# EAGLE design mainboard (EAGLE 7.5.0)
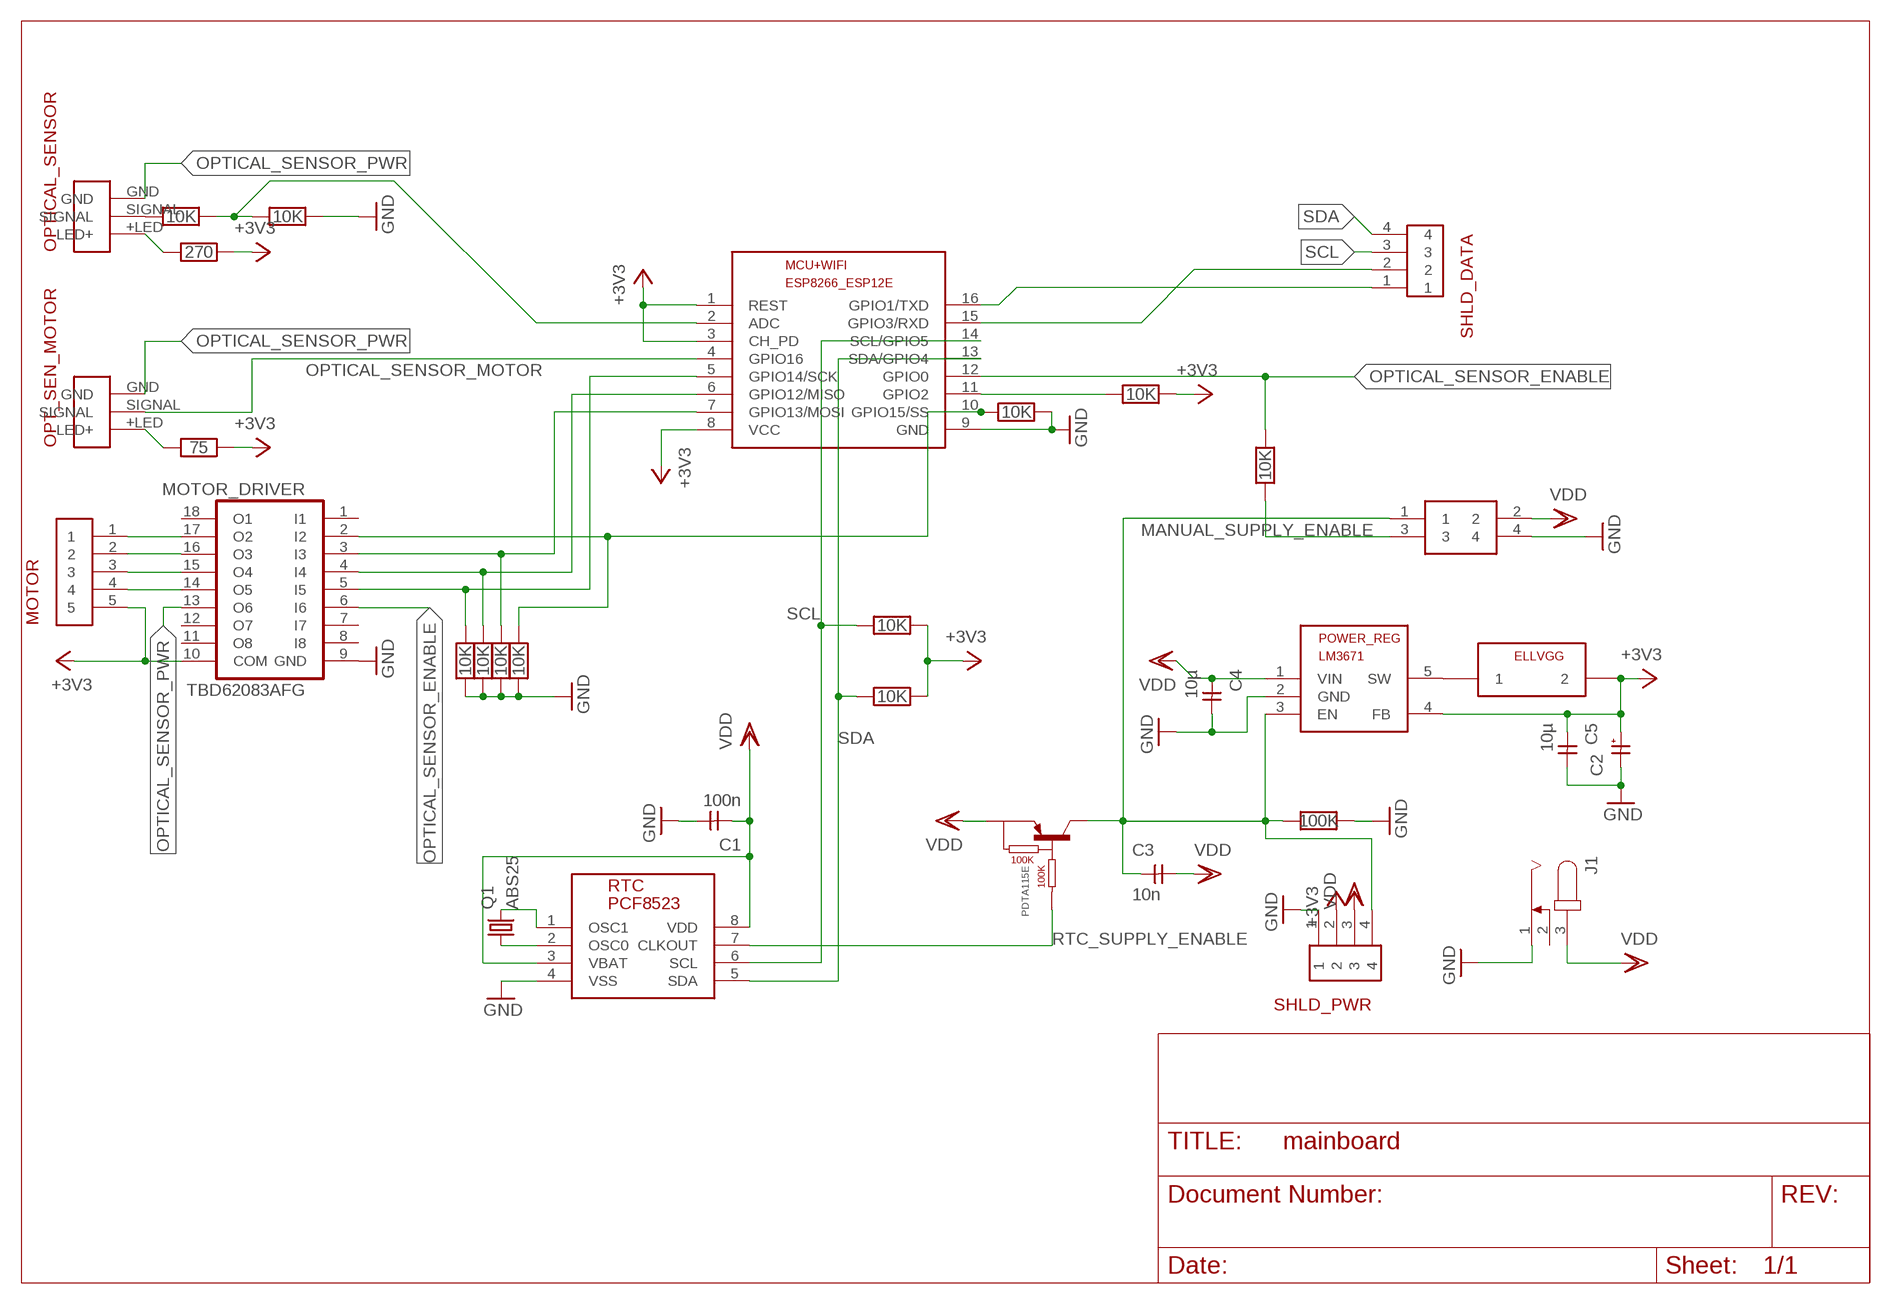
[diagram p0: schematic, sheet 1]

## Parts
C1  100n  CSMD_1206  [SMD_RC_1206]
C2  C_POLSMD_M6.3  [C_M6.3]
C3  10n  CSMD_1206  [SMD_RC_1206]
C4  10µ  CSMD_1206  [SMD_RC_1206]
C5  10µ  CSMD_1206  [SMD_RC_1206]
DIL_SWITCH  HEADER_2X2  [HEADER_2X2]
J1  JACK-PLUG0  [SPC4077]
L1  ELLVGG  [ELLVGG]
MCU+WIFI  ESP8266-12EESP8266-ESP12E  [ESP8266-ESP12E]
MOTOR  B5B-XH-A  [B5B-XH-A]
MOTOR_DRIVER  TBD62083AFG  [SO18]
OPT_SEN_MOTOR  ENDSTOP  [ENDSTOP]
OPTICAL_SENSOR  ENDSTOP  [ENDSTOP]
POWER_REG  LM3671NO_EXTRA_PAD  [SOT23-5L-SIMPLE]
Q1  ABS25  [ABS25]
R1  270  RSMD_1206  [SMD_RC_1206]
R2  10K  RSMD_1206  [SMD_RC_1206]
R3  10K  RSMD_1206  [SMD_RC_1206]
R4  100K  RSMD_1206  [SMD_RC_1206]
R5  10K  RSMD_1206  [SMD_RC_1206]
R6  10K  RSMD_1206  [SMD_RC_1206]
R7  10K  RSMD_1206  [SMD_RC_1206]
R8  10K  RSMD_1206  [SMD_RC_1206]
R9  10K  RSMD_1206  [SMD_RC_1206]
R10  10K  RSMD_1206  [SMD_RC_1206]
R11  10K  RSMD_1206  [SMD_RC_1206]
R12  10K  RSMD_1206  [SMD_RC_1206]
R13  10K  RSMD_1206  [SMD_RC_1206]
R14  75  RSMD_1206  [SMD_RC_1206]
RTC  PCF8523TS  [SO8]
SHLD_DATA  HEADER_1X4  [HEADER_1X4]
SHLD_PWR  HEADER_1X4  [HEADER_1X4]
T1  PDTA115ET  [SOT23]

## Nets
+3V3: C2.+ C5.P$1 L1.P$2 MCU+WIFI.1(REST) MCU+WIFI.3(CH_PD) MCU+WIFI.8(VCC) MOTOR.5 MOTOR_DRIVER.10(COM) POWER_REG.4(FB) R1.P$2 R9.P$2 R10.P$2 R11.P$2 R14.P$2 SHLD_PWR.2
GND: C1.P$2 C2.GND C4.P$2 C5.P$2 DIL_SWITCH.4 J1.1 MCU+WIFI.9(GND) MOTOR_DRIVER.9(GND) POWER_REG.2(GND) R3.P$2 R4.P$1 R5.P$1 R6.P$1 R7.P$2 R12.P$1 R13.P$1 RTC.4(VSS) SHLD_PWR.1
MANUAL_SUPPLY_ENABLE: C3.P$1 DIL_SWITCH.1 POWER_REG.3(EN) R4.P$2 SHLD_PWR.4 T1.3(C)
N$1: MOTOR.1 MOTOR_DRIVER.17(O2)
N$2: Q1.4 RTC.1(OSC1)
N$3: L1.P$1 POWER_REG.5(SW)
N$4: MOTOR.2 MOTOR_DRIVER.16(O3)
N$6: MCU+WIFI.7(GPIO13/MOSI) MOTOR_DRIVER.3(I3) R12.P$2
N$7: MCU+WIFI.6(GPIO12/MISO) MOTOR_DRIVER.4(I4) R6.P$2
N$8: MOTOR.3 MOTOR_DRIVER.15(O4)
N$9: MOTOR.4 MOTOR_DRIVER.14(O5)
N$10: OPT_SEN_MOTOR.+LED(LED+) R14.P$1
N$11: MCU+WIFI.11(GPIO2) R11.P$1
N$13: MCU+WIFI.16(GPIO1/TXD) SHLD_DATA.1
N$14: MCU+WIFI.15(GPIO3/RXD) SHLD_DATA.2
N$16: MCU+WIFI.5(GPIO14/SCK) MOTOR_DRIVER.5(I5) R5.P$2
N$17: MCU+WIFI.10(GPIO15/SS) MOTOR_DRIVER.2(I2) R7.P$1 R13.P$2
N$18: MCU+WIFI.2(ADC) R2.P$2 R3.P$1
N$19: DIL_SWITCH.3 R8.P$2
N$20: OPTICAL_SENSOR.SIGNAL R2.P$1
N$22: OPTICAL_SENSOR.+LED(LED+) R1.P$1
OPTICAL_SENSOR_ENABLE: MCU+WIFI.12(GPIO0) MOTOR_DRIVER.6(I6) R8.P$1
OPTICAL_SENSOR_MOTOR: MCU+WIFI.4(GPIO16) OPT_SEN_MOTOR.SIGNAL
OPTICAL_SENSOR_PWR: MOTOR_DRIVER.13(O6) OPT_SEN_MOTOR.GND OPTICAL_SENSOR.GND
RTC_OSC: Q1.1 RTC.2(OSC0)
RTC_SUPPLY_ENABLE: RTC.7(CLKOUT) T1.1(B)
SCL: MCU+WIFI.14(SCL/GPIO5) R9.P$1 RTC.6(SCL) SHLD_DATA.3
SDA: MCU+WIFI.13(SDA/GPIO4) R10.P$1 RTC.5(SDA) SHLD_DATA.4
VDD: C1.P$1 C3.P$2 C4.P$1 DIL_SWITCH.2 J1.3 POWER_REG.1(VIN) RTC.3(VBAT) RTC.8(VDD) SHLD_PWR.3 T1.2(E)
Unconnected: J1.2 MOTOR_DRIVER.1(I1) MOTOR_DRIVER.7(I7) MOTOR_DRIVER.8(I8) MOTOR_DRIVER.11(O8) MOTOR_DRIVER.12(O7) MOTOR_DRIVER.18(O1)

## Library data of the parts
C1 C3-C5 = balance:C
C2 = balance:C_POL
DIL_SWITCH = balance:HEADER_2X2
J1 = con-jack:JACK-PLUG: DC POWER JACK Power Jack, DC, Right Angle, Through Hole, Rated 5A at 16VDC, PC Terminals Distributor: Farnell (www.Farnell.de) Drawing: 84N1161.pdf / 84N1162.pdf Manufacturer: SPC Technology (www.spctechnology.com) Type: SPC4077 / SPC 4078; OC_FARNELL: unknown; OC_NEWARK: unknown
L1 = balance:ELLVGG
MCU+WIFI = balance:ESP8266-12E: ESP8266-12E with additional I/O and GPIO04/05 corrected The author cannot warrant that this library is free from error or will meet your specific requirements. Created by PuceBaboon.com. Komagane, Nagano, JAPAN
MOTOR = balance:B5B-XH-A
MOTOR_DRIVER = balance:TBD62083AFG: DRIVER ARRAY
OPT_SEN_MOTOR OPTICAL_SENSOR = balance:ENDSTOP
POWER_REG = balance:LM3671
Q1 = balance:ABS25: kHz RANGE CRYSTAL UNIT SMD Source: MC-306_405_406_E07X.PDF Homepage <http://www.epsontoyocom.co.jp>
R1-R14 = balance:R
RTC = balance:PCF8523TS
SHLD_DATA SHLD_PWR = balance:HEADER_1X4
T1 = balance:PDTA115ET

## Net classes
0 default: clearance 0.205 mm

## Board
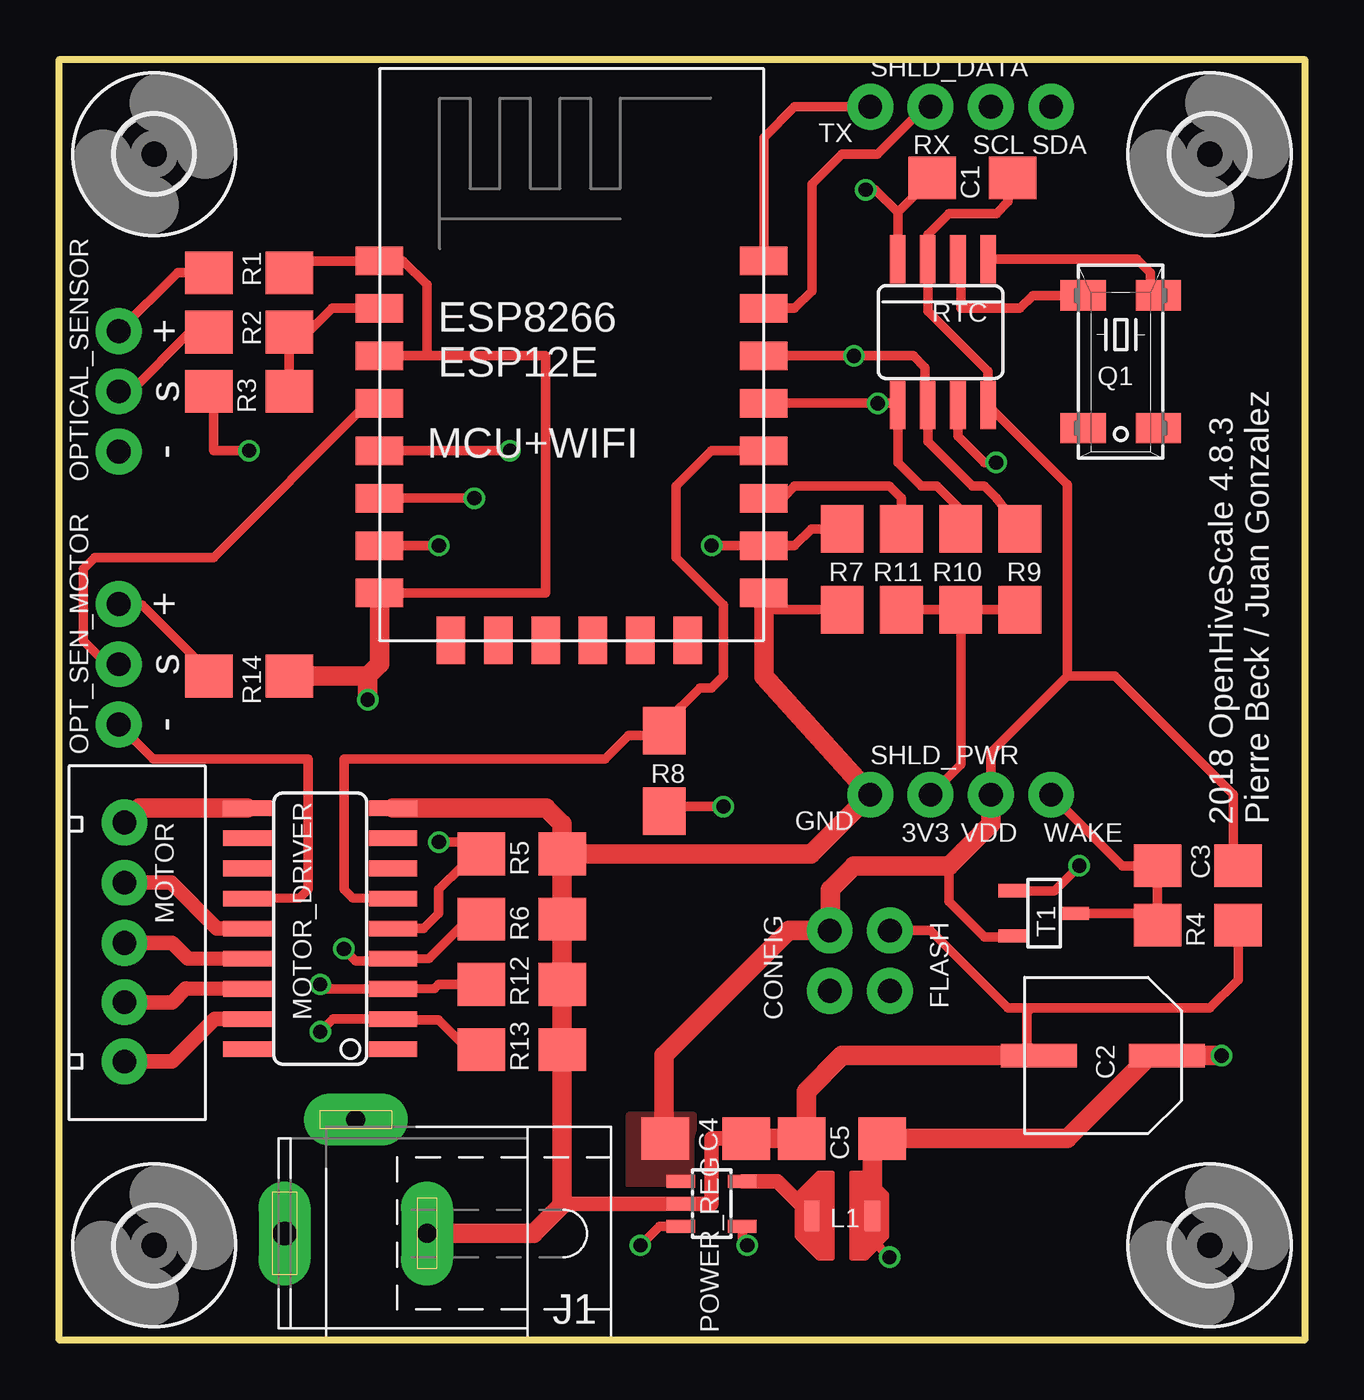
[diagram p1: board, top side]
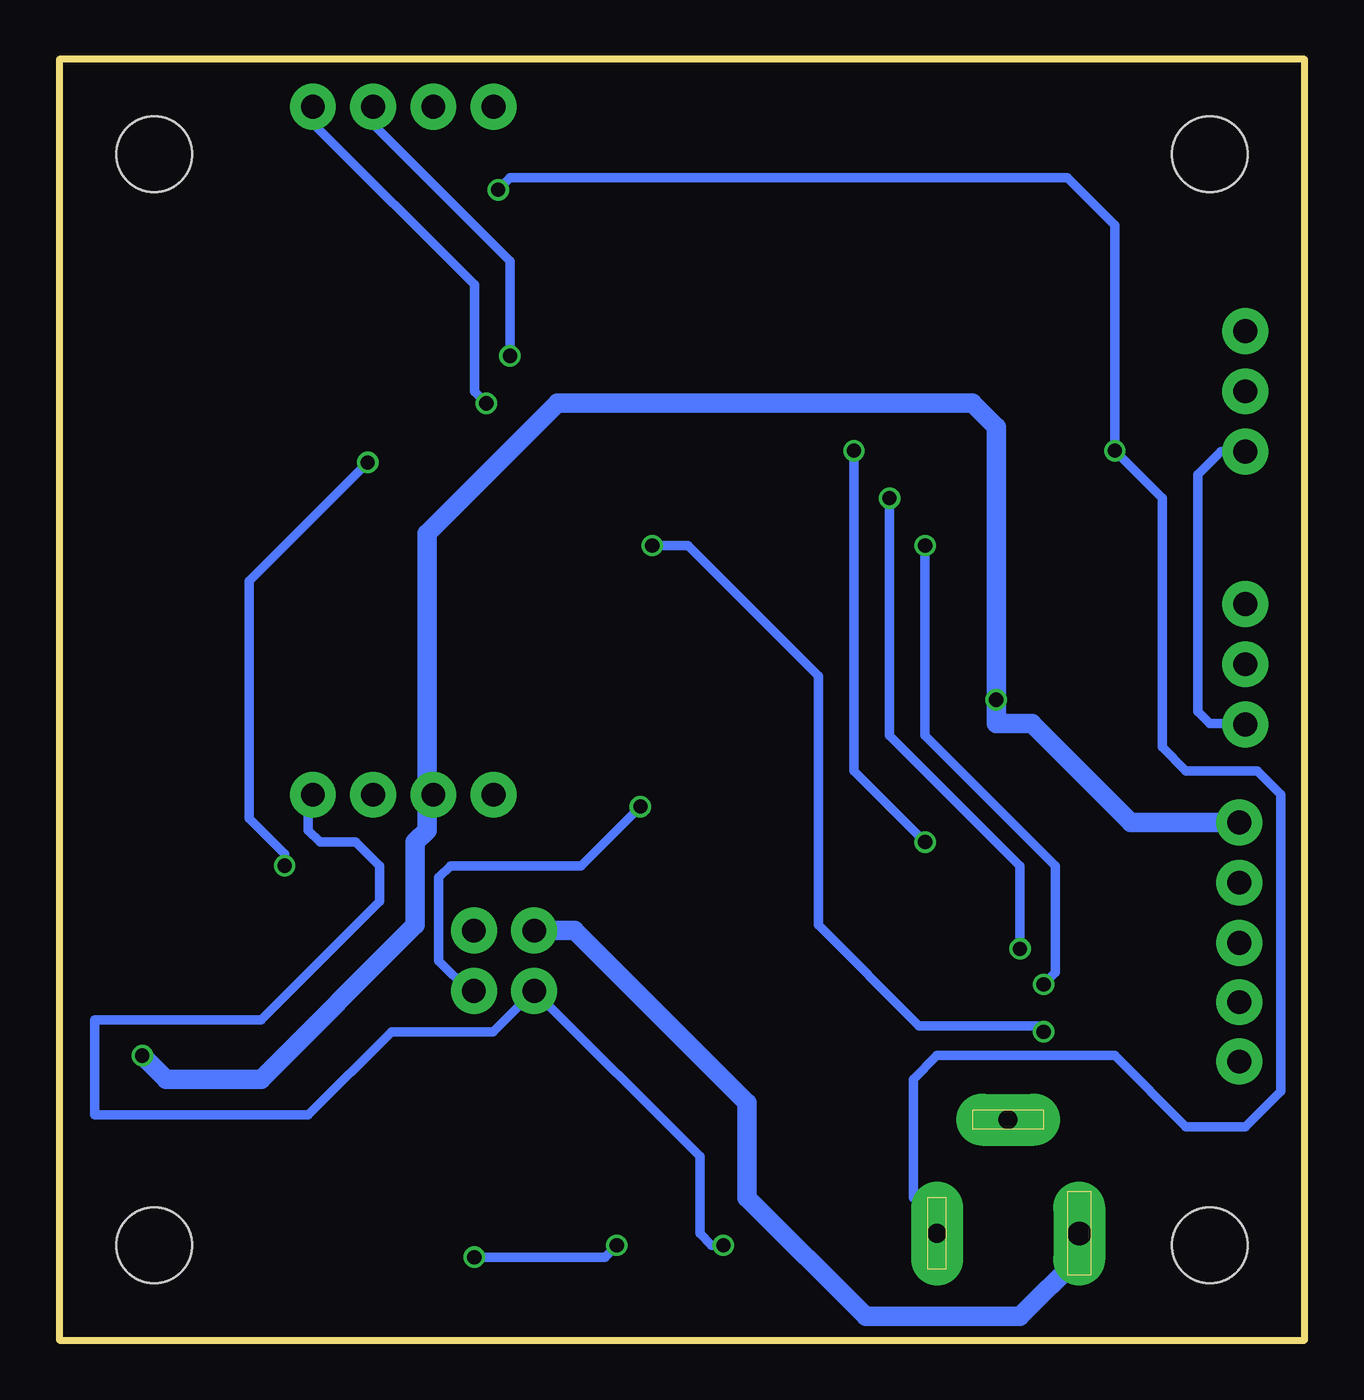
[diagram p2: board, bottom side, seen from below]

Size 52.5 x 54 mm. Coordinates in mm from the lower left corner, seen from the top.
Outline: 0,0 0,54 52.5,54 52.5,0 0,0
Copper layers (1*16): Top 0.035mm / dielectric 1.5mm / Bottom 0.035mm
Design rules "SeeedStudio_2layer_DRU_no_angle_20140221": minimum track width 6mil, minimum drill 12mil, track to track 6mil, track to pad 6mil, pad to pad 6mil, via to via 6mil, smd to smd 0mil, copper to edge 10mil, drill to drill 10mil, minimum pad ring 10mil, minimum via ring 6mil, stop-mask expansion 2mil, vias tented up to drill 100mil, thermal gap 10mil

### Footprints (pad centres in the part's own frame; a part is rotated, then mirrored left to right if it is on the bottom)
SMD_RC_1206 = smd 2 x 1.8: P$1 -1.7,0; P$2 1.7,0
C_M6.3 = smd 3.2 x 1: + 2.7,0; GND -2.7,0
HEADER_2X2 = drill 1 pad 1.93: 1 -1.27,1.27; 2 1.27,1.27; 3 -1.27,-1.27; 4 1.27,-1.27
SPC4077 = drill 0.8 pad 2.184 long: 1 -3,0; 2 0,-4.8 | drill 1 pad 2.184 long: 3 3,0
ELLVGG = smd 0.635 x 1.27: P$1 -1.27,0; P$2 1.27,0
ESP8266-ESP12E = smd 2 x 1.2: 1 0,16; 2 0,14; 3 0,12; 4 0,10; 5 0,8; 6 0,6; 7 0,4; 8 0,2; 9 16.2,2; 10 16.2,4; 11 16.2,6; 12 16.2,8; 13 16.2,10; 14 16.2,12; 15 16.2,14; 16 16.2,16 | smd 1.2 x 2: 17 3,0; 18 5,0; 19 7,0; 20 9,0; 21 11,0; 22 13,0
B5B-XH-A = drill 1 pad 1.93: 1 5,0; 2 2.5,0; 3 0,0; 4 -2.54,0; 5 -5.08,0
SO18 = smd 0.66 x 2.032: 1 -5.08,-3.073; 2 -3.81,-3.073; 3 -2.54,-3.073; 4 -1.27,-3.073; 5 0,-3.073; 6 1.27,-3.073; 7 2.54,-3.073; 8 3.81,-3.073; 9 5.08,-3.073; 10 5.08,3.073; 11 3.81,3.073; 12 2.54,3.073; 13 1.27,3.073; 14 0,3.073; 15 -1.27,3.073; 16 -2.54,3.073; 17 -3.81,3.073; 18 -5.08,3.073
ENDSTOP = drill 1 pad 1.93: +LED 2.54,0; GND -2.54,0; SIGNAL 0,0
SOT23-5L-SIMPLE = smd 0.55 x 1.2: 1 -0.95,-1.3; 2 0,-1.3; 3 0.95,-1.3; 4 0.95,1.3; 5 -0.95,1.3
ABS25 = smd 1.27 x 1.905: 1 -2.794,-1.587; 2 2.794,-1.587; 3 2.794,1.587; 4 -2.794,1.587
SO8 = smd 0.66 x 2.032: 1 -1.905,-3.073; 2 -0.635,-3.073; 3 0.635,-3.073; 4 1.905,-3.073; 5 1.905,3.073; 6 0.635,3.073; 7 -0.635,3.073; 8 -1.905,3.073
HEADER_1X4 = drill 1 pad 1.93: 1 -3.81,0; 2 -1.27,0; 3 1.27,0; 4 3.81,0
SOT23 = smd 0.55 x 1.2: 1 0.95,1.3; 2 -0.95,1.3; 3 0,-1.3
3,2 = hole 3.2: 0,0

### Placement (x,y rotation side)
C1  38.5,49 180 top
C2  44,12 0 top
C3  48,20 0 top
C4  27.25,8.5 0 top
C5  33,8.5 180 top
DIL_SWITCH  33.75,16 90 top
J1  12.5,4.5 180 top
L1  33,5.25 0 top
MCU+WIFI  13.5,29.5 0 top
MOTOR  2.75,16.75 270 top
MOTOR_DRIVER  11,17.35 90 top
OPT_SEN_MOTOR  2.5,28.5 90 top
OPTICAL_SENSOR  2.5,40 90 top
POWER_REG  27.5,5.75 270 top
Q1  44.75,41.25 270 top
R1  8,45 0 top
R2  8,42.5 0 top
R3  8,40 180 top
R4  48,17.5 180 top
R5  19.5,20.5 180 top
R6  19.5,17.75 180 top
R7  33,32.5 270 top
R8  25.5,24 270 top
R9  40.5,32.5 270 top
R10  38,32.5 270 top
R11  35.5,32.5 270 top
R12  19.5,15 180 top
R13  19.5,12.25 180 top
R14  8,28 0 top
RTC  37.25,42.5 180 top
SHLD_DATA  38,52 0 top
SHLD_PWR  38,23 0 top
T1  41.5,18 90 top
U$2  [3,2]  4,4 0 top
U$3  [3,2]  4,50 0 top
U$4  [3,2]  48.5,50 0 top
U$5  [3,2]  48.5,4 0 top

### Tracks (layer width: path | path; a pad name or v marks a point on that pad's centre or on a via)
+3V3  (via drill 0.6)
  Top 0.406: POWER_REG.4 28.8,4.2 v29,4 | L1.P$2 34.27,4.23 v35,3.5 | R10.P$2 R9.P$2 | 15.5,41.5 MCU+WIFI.3 | 15.5,41.5 15.5,44.5 14.5,45.5 MCU+WIFI.1 10.5,45.5 R1.P$2 | R11.P$2 R10.P$2 | R10.P$2 38,24.27 SHLD_PWR.2 | MCU+WIFI.8 20.5,31.5 20.5,41.5 15.5,41.5
  Top 0.61: 9.5,27.8 R14.P$2
  Top 0.813: L1.P$2 34.27,8.07 C5.P$1 42.5,8.5 46,12 C2.+ v49,12 | MCU+WIFI.8 13.5,28.5 13,28 | R14.P$2 13,28 | MOTOR_DRIVER.10 3.37,22.45 MOTOR.5 | 13,28 v13,27
  Bottom 0.406: v35,3.5 29.5,3.5 v29,4
  Bottom 0.813: MOTOR.5 7.33,21.83 11.5,26 13,26 v13,27 13,38.5 14,39.5 31.5,39.5 37,34 37,23.27 SHLD_PWR.2 37,22.73 37,21.5 37.5,21 37.5,17.5 44,11 48,11 v49,12
GND  (via drill 0.6)
  Top 0.406: 35.34,47.55 RTC.4 35.34,47.16 | 35.34,47.55 C1.P$2 | v34,48.5 34.39,48.5 35.34,47.55 | R7.P$2 30,30.8 29.7,30.5 | R3.P$2 6.5,40 6.5,37.5 v8,37.5 | R4.P$1 49.7,15.2 48.5,14 41,14 | DIL_SWITCH.4 36.73,17.27 40,14 41,14 | 41,14 40.8,13.8 40.8,12.5 C2.GND
  Top 0.61: C4.P$2 27.5,8.5 27.5,5.75 POWER_REG.2 21.45,5.75 21.2,6
  Top 0.813: C4.P$2 C5.P$2 31.5,8.5 31.5,10.5 33,12 C2.GND | MOTOR_DRIVER.9 20.52,22.45 21.2,21.77 R5.P$1 | MCU+WIFI.9 29.7,30.5 29.7,27.99 SHLD_PWR.1 31.69,20.5 R5.P$1 | J1.1 20,4.5 21.2,5.7 21.2,6 R13.P$1 R12.P$1 R6.P$1 R5.P$1
  Bottom 0.406: v34,48.5 33.5,49 10,49 8,47 v8,37.5 6,35.5 6,25 5,24 2,24 1,23 1,10.5 2.5,9 5,9 8,12 15.5,12 16.5,11 16.5,6 16,5.5 16,4.5 15.5,5
  Bottom 0.813: 15.5,5.5 15.5,5 J1.1
MANUAL_SUPPLY_ENABLE  (via drill 0.6)
  Top 0.406: T1.3 45.8,18 R4.P$2 C3.P$1 44.81,20 SHLD_PWR.4 | POWER_REG.3 25.3,4.8 v24.5,4
  Bottom 0.406: v24.5,4 25,4 25.5,4.5 25.5,7.75 DIL_SWITCH.1 34.21,13 38.5,13 42,9.5 51,9.5 51,13.5 44,13.5 39,18.5 39,20 40,21 41.5,21 42,21.5 42,22.81 SHLD_PWR.4
N$1
  Top 0.61: MOTOR_DRIVER.17 6.55,13.55 4.75,11.75 MOTOR.1
N$2
  Top 0.406: RTC.1 45.43,45.57 46,45 46,44.38 Q1.4
N$3
  Top 0.61: POWER_REG.5 30.28,6.7 L1.P$1
N$4
  Top 0.61: MOTOR_DRIVER.16 5.33,14.82 4.75,14.25 MOTOR.2
N$6  (via drill 0.6)
  Top 0.406: R12.P$2 16,15 15.82,14.82 MOTOR_DRIVER.3 11.19,14.81 v11,15 | MCU+WIFI.7 v16,33.5
  Bottom 0.406: v16,33.5 16,25.5 10.5,20 10.5,15.5 v11,15
N$7  (via drill 0.6)
  Top 0.406: R6.P$2 17.55,17.5 17,17.5 15.6,16.09 MOTOR_DRIVER.4 13.98,16 12.5,16 v12,16.5 | MCU+WIFI.6 v17.5,35.5
  Bottom 0.406: v17.5,35.5 17.5,25.5 12,20 v12,16.5
N$8
  Top 0.61: MOTOR_DRIVER.15 5.41,16.09 4.75,16.75 MOTOR.3
N$9
  Top 0.61: MOTOR_DRIVER.14 6.63,17.36 4.71,19.29 MOTOR.4
N$10
  Top 0.406: R14.P$1 6.3,28.2 3.5,31 2.54,31 OPT_SEN_MOTOR.+LED
N$11
  Top 0.406: R11.P$1 35.5,35.5 35,36 31,36 30.5,35.5 MCU+WIFI.11
N$13
  Top 0.406: SHLD_DATA.1 31,52 29.7,50.7 MCU+WIFI.16
N$14
  Top 0.406: MCU+WIFI.15 31,43.5 31.73,44.23 31.73,48.73 33,50 34.5,50 36.5,52 SHLD_DATA.2
N$16  (via drill 0.6)
  Top 0.406: MOTOR_DRIVER.5 15.37,17.36 16,18 16,19 17,20 17.3,20 R5.P$2 17.3,21 v16,21 | MCU+WIFI.5 v19,37.5
  Bottom 0.406: v19,37.5 19,24 v16,21
N$17  (via drill 0.6)
  Top 0.406: R7.P$1 31.7,34.2 31,33.5 MCU+WIFI.10 v27.5,33.5 | R13.P$2 17.25,12.25 16,13.5 14.13,13.5 MOTOR_DRIVER.2 11.54,13.54 v11,13
  Bottom 0.406: v27.5,33.5 26,33.5 20.5,28 20.5,17.5 16.25,13.25 11.25,13.25 v11,13
N$18
  Top 0.406: R3.P$1 R2.P$2 10.5,42.5 11.5,43.5 MCU+WIFI.2
N$19  (via drill 0.6)
  Top 0.406: v28,22.5 25.7,22.5 R8.P$2
  Bottom 0.406: DIL_SWITCH.3 35.23,14.73 36.5,16 36.5,19.5 36,20 30.5,20 v28,22.5
N$20
  Top 0.406: OPTICAL_SENSOR.SIGNAL 3,40 5.5,42.5 R2.P$1
N$22
  Top 0.406: OPTICAL_SENSOR.+LED 5,45 R1.P$1
OPTICAL_SENSOR_ENABLE
  Top 0.406: MCU+WIFI.12 27.5,37.5 26,36 26,33 28,31 28,28 27.5,27.5 27,27.5 25.5,26 R8.P$1 25.3,25.5 24,25.5 23,24.5 12,24.5 12,19 12.37,18.64 MOTOR_DRIVER.6
OPTICAL_SENSOR_MOTOR
  Top 0.406: MCU+WIFI.4 13,39.5 6.5,33 1.5,33 1,32.5 1,29.5 2,28.5 OPT_SEN_MOTOR.SIGNAL
OPTICAL_SENSOR_PWR
  Top 0.406: MOTOR_DRIVER.13 10.13,18.64 10.5,19 10.5,24.5 3.96,24.5 OPT_SEN_MOTOR.GND
  Bottom 0.406: OPTICAL_SENSOR.GND 3.54,37.46 4.5,36.5 4.5,26.5 4,26 2.54,26 OPT_SEN_MOTOR.GND
RTC_OSC
  Top 0.406: Q1.1 41.04,44.04 40.5,43.5 38,43.5 38,45.46 RTC.2
RTC_SUPPLY_ENABLE  (via drill 0.6)
  Top 0.406: RTC.7 37.88,38.12 39,37 v39.5,37 | T1.1 41.95,18.95 v43,20
  Bottom 0.406: v43,20 43,20.5 44.5,22 44.5,32 v39.5,37
SCL  (via drill 0.6)
  Top 0.406: MCU+WIFI.14 v33.5,41.5 36,41.5 36.5,41 36.5,39.54 RTC.6 36.62,37.88 38.5,36 39,36 39.5,35.5 R9.P$1
  Bottom 0.406: SHLD_DATA.3 39.27,51.27 33.5,45.5 v33.5,41.5
SDA  (via drill 0.6)
  Top 0.406: MCU+WIFI.13 v34.5,39.5 35.27,39.5 RTC.5 35.34,37 36.34,36 37,36 38,35 R10.P$1
  Bottom 0.406: SHLD_DATA.4 41.81,51.31 35,44.5 35,40 v34.5,39.5
VDD
  Top 0.406: C1.P$1 40,48.8 40,48 39.5,47.5 37.5,47.5 36.62,46.62 RTC.3 36.62,43.38 39.16,40.84 RTC.8 42.5,36.08 42.5,28 | SHLD_PWR.3 39.27,24.77 42.5,28 | T1.2 40.15,17 39,17 37.5,18.5 37.5,20 | C3.P$2 49.5,20.2 49.5,23 44.5,28 42.5,28
  Top 0.813: C4.P$1 25.5,8.55 25.5,12 30.77,17.27 DIL_SWITCH.2 32.5,17.29 32.5,19 33.5,20 37.5,20 39.27,21.77 SHLD_PWR.3
  Bottom 0.813: J1.3 9.5,3.5 12,1 18.5,1 23.5,6 23.5,10 30.77,17.27 DIL_SWITCH.2
  pour Top (isolate 0.406, no thermals): 26.75,6.5 26.75,9.5 24,9.5 24,6.5

### Text on the board
tNames: TX | RX | SCL | SDA | GND | 2018 OpenHiveScale 4.8.3 / Pierre Beck / Juan Gonzalez | 3V3 | VDD | WAKE | CONFIG | FLASH